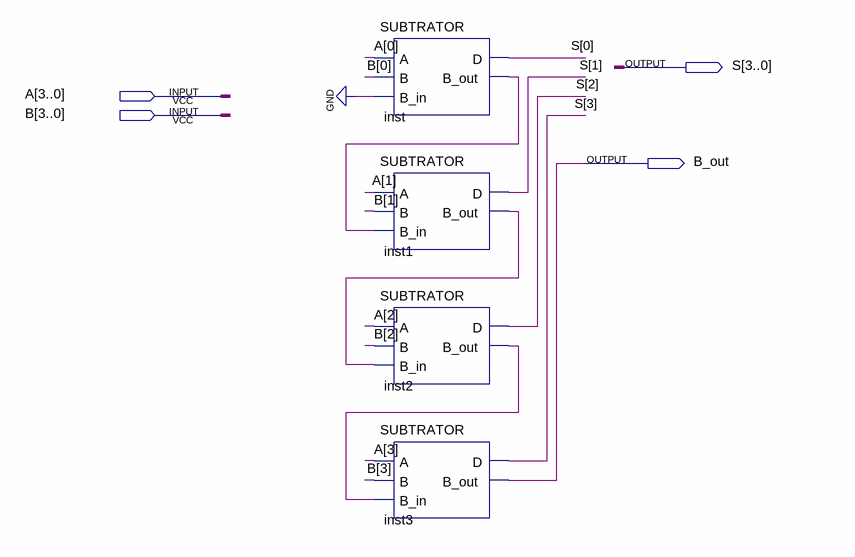
[diagram p0: schematic sheet]
// Quartus schematic SUBTRATOR4.bdf as structural Verilog: 4 symbols, 4 pins
module SUBTRATOR4 (
  input  [3:0] A,
  input  [3:0] B,
  output [3:0] S,
  output B_out
);

  wire inst1_b_out, inst2_b_out, inst_b_out;

  SUBTRATOR inst (.A(A[0]), .B(B[0]), .B_in(1'b0), .D(S[0]), .B_out(inst_b_out));
  SUBTRATOR inst1 (.A(A[1]), .B(B[1]), .B_in(inst_b_out), .D(S[1]), .B_out(inst1_b_out));
  SUBTRATOR inst2 (.A(A[2]), .B(B[2]), .B_in(inst1_b_out), .D(S[2]), .B_out(inst2_b_out));
  SUBTRATOR inst3 (.A(A[3]), .B(B[3]), .B_in(inst2_b_out), .D(S[3]), .B_out(B_out));
endmodule
